# Altium project Blue Tractor_v1.1-2021.PrjPCB (part 1 of 4)
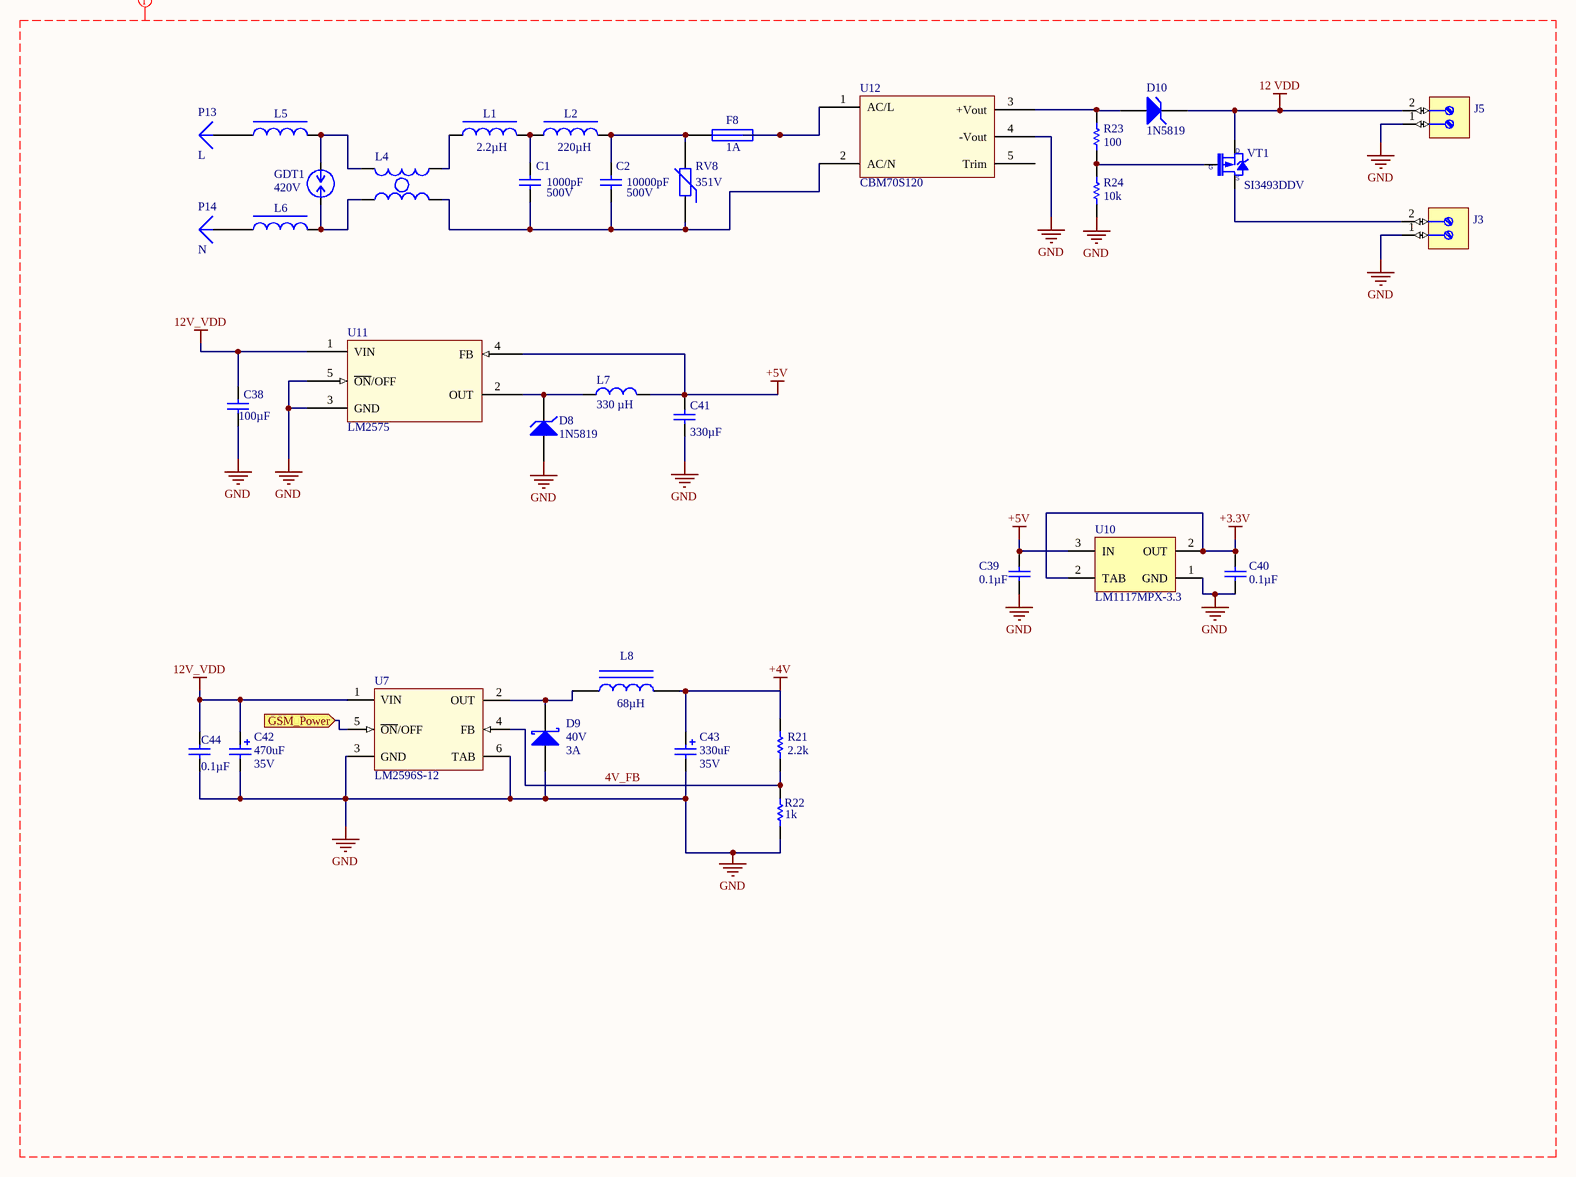
[diagram p0: [09] EMC-Power.SchDoc]
13 sheets, 161 parts. Net scope: global (net labels, ports and power ports of the same name join across sheets).
Sheets:
  [09] EMC-Power.SchDoc
  Blue Tractor_v1.1-2021.SchDoc
    STM32F4 = [01] - MC.SchDoc
    MOSFET = [11] - MOSFET.SchDoc
    RFID = [10] - RFID.SchDoc
    USB = [04] - USB-UART.SchDoc
    LoRa = [08] -LoRa_RAK3172.SchDoc
    ESP32-S2-MINI-1U = [03] - WiFi.SchDoc
    SD = [07] - SD.SchDoc
    GSM = [02] - GSM.SchDoc
    1 Wire_TMP = [05] - Sensors.SchDoc
    IO_Ports = [06] - IO_Ports.SchDoc
    RTC = [12] - RTC.SchDoc

## Sheet [09] EMC-Power.SchDoc
size A3; PageSetup: Record=PageOptions|CenterHorizontal=True|CenterVertical=True|PrintScale=0.94|XCorrection=1.00|YCorrection=1.00|PrintKind=1|BorderSize=5000000|LeftOffset=0|BottomOffset=0|Orientation=1|PaperLength=1000|PaperWidth=1000|Scale=100|PaperSource=7|PrintQuality=-4|MediaType=1|DitherType=10|PaperKind=A4|PrintScaleMode=1; DecimalNumber: Децимальный номер; HeadOfSector: Нач. сектора; MainDevice: Перв.примен.; Name: Наименование

### Parts
C1  Capacitance: 1000pF  Voltage - Rated: 500V  [Cap 1206]  (hidden comment: Capacitor)
C2  Capacitance: 10000pF  Voltage - Rated: 500V  [Cap 1206]  (hidden comment: Capacitor)
C38  value 100µF  [Cap 0603]  (hidden comment: Capacitor)
C39  Capacitance: 0.1µF  [Cap 0603]  (hidden comment: Capacitor)
C40  Capacitance: 0.1µF  [Cap 0603]  (hidden comment: Capacitor)
C41  value 330µF  [Cap 0603]  (hidden comment: Capacitor)
C42  Capacitance: 470uF  Voltage Rating: 35V  [Aluminium SMD G]  (hidden comment: Capacitor Polarized)
C43  Capacitance: 330uF  Voltage: 35V  [Aluminium SMD G]  (hidden comment: Capacitor Polarized)
C44  Capacitance: 0.1µF  [Cap 0603]  (hidden comment: Capacitor)
D8  1N5819  [D100]
D9  Output Current: 3A  Voltage: 40V  [SMA]  (hidden comment: SK32)
D10  1N5819  [D100]
F8  value 1A  [Fuse]  (hidden comment: Fuse)
GDT1  Voltage - DC Spark Over (Nom): 420V  [GDT]  (hidden comment: Gas Discharge Tube)
J3  (no value)  [PHOENIX_1715721]
J5  (no value)  [PHOENIX_1715721]
L1  Inductance: 2.2µH  [Inductor VLS]  (hidden comment: Inductor)
L2  Inductance: 220µH  [SRR1260]  (hidden comment: Inductor)
L4  Current-compensated Chokes  [RN114_PM3700]  (value not drawn)
L5  Inductor  [FB20022-4B-RC]  (value not drawn)
L6  Inductor  [FB20022-4B-RC]  (value not drawn)
L7  value 330 µH  [IND4]  (hidden comment: Inductor)
L8  Inductance: 68µH  [SRR1208]  (hidden comment: SRR1210)
P13  L  [Socket]  (no BOM)
P14  N  [Socket]  (no BOM)
R21  Resistance: 2.2k  [Res-0603]  (hidden comment: Res1)
R22  Resistance: 1k  [Res-0603]  (hidden comment: Res1)
R23  Resistance: 100  [Res-0603]  (hidden comment: Res1)
R24  Resistance: 10k  [Res-0603]  (hidden comment: Res1)
RV8  Varistor Voltage (Min): 351V  [S14k250]  (hidden comment: Res Varistor)
U7  LM2596S-12  (graphical)
U10  LM1117MPX-3.3  [SOT-223]
U11  LM2575
U12  CBM70S120
VT1  SI3493DDV

### Ports
GSM_Power (in)

### Nets
12 VDD: D10.2(K) J5.2 VT1.16
12V_VDD: C38.2 C42.1 C44.2 U7.1(VIN) U11.1(VIN)
+3.3V: C40.2 U10.2(OUT)
+4V: C43.1 L8.2 R21.1
+5V: C39.2 C41.2 L7.2 U10.3(IN) U11.4(FB)
GND: C38.1 C39.1 C40.1 C41.1 C42.2 C43.2 C44.1 D8.1(A) D9.1(A) J3.1 J5.1 R22.1 R24.2 U7.3(GND) U7.6(TAB) U10.1(GND) U11.3(GND) U11.5(~{ON}/OFF) U12.4(-Vout)
4V_FB: R21.2 R22.2 U7.4(FB)
NetC1_1: C1.1 C2.1 L4.2 RV8.1 U12.2(AC/N)
NetC1_2: C1.2 L1.2 L2.1
NetC2_2: C2.2 F8.1 L2.2 RV8.2
NetD8_2: D8.2(K) L7.1 U11.2(OUT)
NetD9_2: D9.2(K) L8.1 U7.2(OUT)
NetD10_1: D10.1(A) R23.1 U12.3(+Vout)
NetF8_2: F8.2 U12.1(AC/L)
NetGDT1_1: GDT1.1 L4.3 L5.2
NetGDT1_2: GDT1.2 L4.1 L6.2
NetJ3_2: J3.2 VT1.17
NetL1_1: L1.1 L4.4
NetL5_1: L5.1 P13.1
NetL6_1: L6.1 P14.1
NetR23_2: R23.2 R24.1 VT1.15(PG)
NetU7_5: U7.5(~{ON}/OFF) ; port GSM_Power

Not connected (* = marked no-connect by the designer): U12 5(Trim)

### Layout directives
net class HV: 4V_FB, 12 VDD, 12V_VDD, +3.3V, +4V, +5V, GND

### Notes on the sheet
- Title
- Size:
- Date:
- A3
- Number:
- Time:
- Revision:
- Sheet
- of
- File:
- (in symbol SI3493DVV-T1-GE3) D; G; S

### Library data of the parts
C1 = 1: Chip Capacitor Nonpolar; Manufacturer: Samsung Electro-Mechanics America, Inc; Manufacturer Part Number: CL31B102KGFNFNE; ID: 1; Lybrary Path: Capacitors.SchLib; Tolerance: ±10%; Temperature Coefficient: X7R; Published: 8-Jun-2000; LatestRevisionDate: 17-Jul-2002; LatestRevisionNote: Re-released for DXP Platform.; PackageReference: RAD-0.3; Publisher: Altium Limited; PackageDescription: Radial Cap, Thru-Hole; 2 Leads; 0.3 in Pin Spacing; Supplier 1: Digi-Key; Supplier Part Number 1: 1276-3065-1-ND; RoHS: RoHS Compliant; Category: Capacitors; Stock 1: 2501; Pricing 1: 1=0.19, 10=0.126, 25=0.092, 100=0.0643, 500=0.0459, 1000=0.03902 (USD); Packaging: Cut Tape (CT); Mounting Type: Surface Mount, MLCC; Operating Temperature: -55°C ~ 125°C; Applications: General Purpose; Ratings: -; Package / Case: 1206 (3216 Metric); Size / Dimension: 0.126" L x 0.063" W (3.20mm x 1.60mm); Height - Seated (Max): -; Thickness (Max): 0.055" (1.40mm); Lead Spacing: -; Features: -; Lead Style: -; ComponentLink1URL: http://www.samsungsem.com/kr/front/downloadcms.do?path=/kr/support/product-search/mlcc/__icsFiles/afieldfile/2014/11/05&fileName=S_CL31B102KGFNFNE.pdf; ComponentLink1Description: http://www.samsungsem.com/kr/front/downloadcms.do?path=/kr/support/product-search/mlcc/__icsFiles/afieldfile/2014/11/05&fileName=S_CL31B102KGFNFNE.pdf
C2 = 1: Chip Capacitor Nonpolar; Manufacturer: Samsung Electro-Mechanics America, Inc; Manufacturer Part Number: CL31B103KGFNNNE; Tolerance: ±10%; Temperature Coefficient: X7R; Supplier 1: Digi-Key; Supplier Part Number 1: 1276-3076-1-ND; RoHS: RoHS Compliant; Category: Capacitors; Stock 1: 4460; Pricing 1: 1=0.26, 10=0.216, 25=0.1484, 100=0.108, 500=0.07156, 1000=0.06345 (USD); Packaging: Cut Tape (CT); Mounting Type: Surface Mount, MLCC; Operating Temperature: -55°C ~ 125°C; Applications: General Purpose; Ratings: -; Package / Case: 1206 (3216 Metric); Size / Dimension: 0.126" L x 0.063" W (3.20mm x 1.60mm); Height - Seated (Max): -; Thickness (Max): 0.055" (1.40mm); Lead Spacing: -; Features: -; Lead Style: -; ComponentLink1URL: http://www.samsungsem.com/kr/front/downloadcms.do?path=/kr/support/product-search/mlcc/__icsFiles/afieldfile/2014/11/05&fileName=S_CL31B103KGFNNNE.pdf; ComponentLink1Description: http://www.samsungsem.com/kr/front/downloadcms.do?path=/kr/support/product-search/mlcc/__icsFiles/afieldfile/2014/11/05&fileName=S_CL31B103KGFNNNE.pdf
C38 C41 = 1: Capacitor 0603; Manufacturer: Kemet; Manufacturer Part Number: C0603C473K5RACTU; Capacitance: 0.047µF; Tolerance: ±10%; Voltage - Rated: 50V; Temperature Coefficient: X7R; Supplier 1: Digi-Key; Supplier Part Number 1: 399-7933-1-ND; RoHS: RoHS Compliant; Category: Capacitors; Stock 1: 66523; Pricing 1: 1=0.1, 10=0.059, 25=0.0416, 50=0.0318, 100=0.0269, 250=0.02204, 1000=0.0144 (USD); Packaging: Cut Tape (CT); Mounting Type: Surface Mount, MLCC; Operating Temperature: -55°C ~ 125°C; Applications: General Purpose; Ratings: -; Package / Case: 0603 (1608 Metric); Size / Dimension: 0.063" L x 0.031" W (1.60mm x 0.80mm); Height - Seated (Max): -; Thickness (Max): 0.034" (0.87mm); Lead Spacing: -; Features: -; Lead Style: -; ComponentLink1URL: http://www.kemet.com/docfinder?Partnumber=C0603C473K5RACTU; ComponentLink1Description: http://www.kemet.com/docfinder?Partnumber=C0603C473K5RACTU
C39 C40 C44 = 1: Chip Capacitor Nonpolar; Manufacturer: Kemet; Manufacturer Part Number: C0603C104K5RACTU; Tolerance: ±10%; Voltage - Rated: 50V; Temperature Coefficient: X7R; Supplier 1: Digi-Key; Supplier Part Number 1: 399-5089-1-ND; RoHS: RoHS Compliant; Category: Capacitors; Stock 1: 3992655; Pricing 1: 1=0.1, 10=0.041, 50=0.0222, 100=0.0187, 250=0.01532, 500=0.0131, 1000=0.0102 (USD); Packaging: Cut Tape (CT); Mounting Type: Surface Mount, MLCC; Operating Temperature: -55°C ~ 125°C; Applications: General Purpose; Ratings: -; Package / Case: 0603 (1608 Metric); Size / Dimension: 0.063" L x 0.031" W (1.60mm x 0.80mm); Height - Seated (Max): -; Thickness (Max): 0.034" (0.87mm); Lead Spacing: -; Features: -; Lead Style: -; ComponentLink1URL: http://www.kemet.com/docfinder?Partnumber=C0603C104K5RACTU; ComponentLink1Description: http://www.kemet.com/docfinder?Partnumber=C0603C104K5RACTU
C42 = 4: Aluminium SMD Capacitors; Manufacturer: Nichicon; Manufacturer Part Number: UCL1V471MNL1GS; Tolerance: 20%; Ripple Current: 1.19A; Impedance: 60mR; Leakage Current: 3uA; Life (Hours): 2000Hour; Dissipation Factor: 0.12%; Supplier 1: Digi-Key; Supplier Part Number 1: 493-3961-6-ND; Stock 1: 25815; Pricing 1: 1=0.98, 10=0.747, 100=0.5345 (USD); Mount: Surface Mount; Case/Package: Radial; Number of Pins: 2; Material: Aluminium; Dielectric Material: Aluminium; Min Operating Temperature: -55°C; Max Operating Temperature: 105°C; Packaging: Tape and Reel; Package Quantity: 1; Voltage Rating (DC): 35V; Ripple Current (AC): 1.19A; Termination: SMD/SMT; Diameter: 10mm; Length: 13.5mm; Height: 13.5mm; Height - Seated (Max): 0.531inch; Radiation Hardening: No; REACH SVHC: No SVHC; Lead Free: Lead Free; ComponentLink1URL: https://datasheet.ciiva.com/30521/getdatasheetpartid-743876-30521937.pdf; ComponentLink1Description: https://datasheet.ciiva.com/30521/getdatasheetpartid-743876-30521937.pdf; ComponentLink2URL: https://datasheet.ciiva.com/98/e-cl-98467.pdf; ComponentLink2Description: https://datasheet.ciiva.com/98/e-cl-98467.pdf; ComponentLink3URL: https://datasheet.ciiva.com/98/e-cl-98468.pdf; ComponentLink3Description: https://datasheet.ciiva.com/98/e-cl-98468.pdf; ComponentLink4URL: https://datasheet.ciiva.com/98/e-cl-98469.pdf; ComponentLink4Description: https://datasheet.ciiva.com/98/e-cl-98469.pdf; ComponentLink5URL: https://datasheet.ciiva.com/22661/1910939-22661894.pdf; ComponentLink5Description: https://datasheet.ciiva.com/22661/1910939-22661894.pdf; ComponentLink6URL: https://datasheet.ciiva.com/28458/1910939-28458006.pdf; ComponentLink6Description: https://datasheet.ciiva.com/28458/1910939-28458006.pdf; ComponentLink7URL: https://datasheet.ciiva.com/6153/e-cl-6153975.pdf; ComponentLink7Description: https://datasheet.ciiva.com/6153/e-cl-6153975.pdf; ComponentLink8URL: https://datasheet.ciiva.com/11683/e-cl-11683743.pdf; ComponentLink8Description: https://datasheet.ciiva.com/11683/e-cl-11683743.pdf; ComponentLink9URL: https://datasheet.ciiva.com/16502/e-cl-16502287.pdf; ComponentLink9Description: https://datasheet.ciiva.com/16502/e-cl-16502287.pdf
C43 = 4: Aluminium SMD Capacitors; Manufacturer: Panasonic; Manufacturer Part Number: EEE-1VA331P; Ripple Current (AC): 350mA; Tolerance: 20%; Polarity: Polar; Life (Hours): 2000Hour; Leakage Current: 3uA; Supplier 1: Digi-Key; Supplier Part Number 1: PCE3959DKR-ND; Stock 1: 40084; Pricing 1: 1=0.65, 10=0.482, 100=0.3304 (USD); Mount: Surface Mount,PCB; Case/Package: Radial; Contact Plating: Tin; Min Operating Temperature: -40°C; Max Operating Temperature: 85°C; Voltage Rating: 35V; Packaging: Tape and Reel; Ripple Current: 350mA; Voltage Rating (DC): 35V; Package Quantity: 500; Termination: SMD/SMT; Diameter: 10mm; Length: 10.5mm; Height: 10.2mm; Height - Seated (Max): 0.402inch; Radiation Hardening: No; REACH SVHC: No SVHC; Lead Free: Lead Free; ComponentLink1URL: https://datasheet.ciiva.com/16389/aba0000ce2-16389541.pdf; ComponentLink1Description: https://datasheet.ciiva.com/16389/aba0000ce2-16389541.pdf; ComponentLink2URL: https://datasheet.ciiva.com/30235/11aba0000ce2-30235093.pdf; ComponentLink2Description: https://datasheet.ciiva.com/30235/11aba0000ce2-30235093.pdf; ComponentLink3URL: https://datasheet.ciiva.com/46374/aba0000ce2-46374421.pdf; ComponentLink3Description: https://datasheet.ciiva.com/46374/aba0000ce2-46374421.pdf; ComponentLink4URL: https://datasheet.ciiva.com/43470/aba0000ce2-43470694.pdf; ComponentLink4Description: https://datasheet.ciiva.com/43470/aba0000ce2-43470694.pdf; ComponentLink5URL: https://datasheet.ciiva.com/14593/70255710-14593929.pdf; ComponentLink5Description: https://datasheet.ciiva.com/14593/70255710-14593929.pdf; ComponentLink6URL: https://datasheet.ciiva.com/24025/aba0000ce2-40801-24025561.pdf; ComponentLink6Description: https://datasheet.ciiva.com/24025/aba0000ce2-40801-24025561.pdf; ComponentLink7URL: https://datasheet.ciiva.com/14599/70255710-14599770.pdf; ComponentLink7Description: https://datasheet.ciiva.com/14599/70255710-14599770.pdf; ComponentLink8URL: https://datasheet.ciiva.com/17534/aba0000ce2-17534540.pdf; ComponentLink8Description: https://datasheet.ciiva.com/17534/aba0000ce2-17534540.pdf; ComponentLink9URL: https://datasheet.ciiva.com/31414/aba0000ce2-31414702.pdf; ComponentLink9Description: https://datasheet.ciiva.com/31414/aba0000ce2-31414702.pdf
D8 D10 = D Zener: Zener Diode; Published: 8-Jun-2000; LatestRevisionDate: 17-Jul-2002; LatestRevisionNote: Re-released for DXP Platform.; PackageReference: DIODE-0.7; Publisher: Altium Limited
D9 = SK32: Schottky Rectifier; Manufacturer: Diodes; Manufacturer Part Number: B340A-13-F; Peak Reverse Current: 500uA; Forward Voltage: 500mV; Max Forward Surge Current (Ifsm): 80A; Element Configuration: Single; Polarity: Standard; Capacitance: 250pF; ComponentLink1Description: Manufacturer Link; ComponentLink1URL: http://www.irf.com/; ComponentLink2Description: Datasheet; ComponentLink2URL: http://www.irf.com/product-info/datasheets/data/18tq.pdf; Supplier 1: Digi-Key; Supplier Part Number 1: B340A-FDIDKR-ND; Stock 1: 761735; Pricing 1: 1=0.46, 10=0.373, 100=0.2538, 500=0.19034, 1000=0.14276 (USD); Mount: Surface Mount; Case/Package: SMA; Number of Pins: 2; Weight: 0.002258oz; Contact Plating: Tin,Matte; Min Operating Temperature: -55°C; Max Operating Temperature: 125°C; Forward Current: 3A; Packaging: Tape and Reel; Package Quantity: 5000; Average Rectified Current: 3A; Max Repetitive Reverse Voltage (Vrrm): 40V; Peak Non-Repetitive Surge Current: 80A; Termination: SMD/SMT; Voltage Rating (DC): 40V; Current Rating: 3A; Current: 3A; Max Reverse Voltage (DC): 40V; Length: 4.6mm; Height: 2.3mm; Width: 2.92mm; Radiation Hardening: No; REACH SVHC: No SVHC; Lead Free: Lead Free; ComponentLink3URL: https://datasheet.ciiva.com/4245/861ds30891-4245763.pdf; ComponentLink3Description: https://datasheet.ciiva.com/4245/861ds30891-4245763.pdf; ComponentLink4URL: https://datasheet.ciiva.com/26949/getdatasheetpartid-143394-26949352.pdf; ComponentLink4Description: https://datasheet.ciiva.com/26949/getdatasheetpartid-143394-26949352.pdf; ComponentLink5URL: https://datasheet.ciiva.com/1177/ds30891-1177476.pdf; ComponentLink5Description: https://datasheet.ciiva.com/1177/ds30891-1177476.pdf; ComponentLink6URL: https://datasheet.ciiva.com/1240/ds30891-1240228.pdf; ComponentLink6Description: https://datasheet.ciiva.com/1240/ds30891-1240228.pdf; ComponentLink7URL: https://datasheet.ciiva.com/913/ds30891-913637.pdf; ComponentLink7Description: https://datasheet.ciiva.com/913/ds30891-913637.pdf; ComponentLink8URL: https://datasheet.ciiva.com/913/ds30891-913638.pdf; ComponentLink8Description: https://datasheet.ciiva.com/913/ds30891-913638.pdf; ComponentLink9URL: https://datasheet.ciiva.com/913/ds30891-913639.pdf; ComponentLink9Description: https://datasheet.ciiva.com/913/ds30891-913639.pdf; ComponentLink10URL: https://datasheet.ciiva.com/46393/1911813-46393773.pdf; ComponentLink10Description: https://datasheet.ciiva.com/46393/1911813-46393773.pdf
F8 = 12: Manufacturer: TE Connectivity Raychem Circuit Protection; Manufacturer Part Number: LVR100S; Voltage - Max: 240V; Current - Max: 10A; Current - Trip (It): 2A; R Min/Max: 0.200 ~ 0.330 Ohm; Time to Trip: 21s; Supplier 1: Digi-Key; Supplier Part Number 1: LVR100S-ND; RoHS: RoHS Compliant; Category: Circuit Protection; Stock 1: 4143; Pricing 1: 1=1.74, 10=1.54, 100=1.38, 500=1.18, 1000=1.12, 2000=1.09001, 5000=1.02, 10000=0.87 (USD); Packaging: Bulk; Current - Hold (Ih) (Max): 1A; Package / Case: Radial, Disc; ComponentLink1URL: http://www.te.com/commerce/DocumentDelivery/DDEController?Action=srchrtrv&DocNm=SCD26610&DocType=SS&DocLang=EN; ComponentLink1Description: http://www.te.com/commerce/DocumentDelivery/DDEController?Action=srchrtrv&DocNm=SCD26610&DocType=SS&DocLang=EN
GDT1 = 33: Manufacturer: TE Connectivity Raychem Circuit Protection; Manufacturer Part Number: GTCA28-421M-R05; Impulse Discharge Current (8/20µs): 5000A (5kA); Tolerance: ±20%; Number of Poles: 2; Fail Short: No; Supplier 1: Digi-Key; Supplier Part Number 1: GTCA28-421M-R05-ND; RoHS: RoHS Compliant; Category: Circuit Protection; Stock 1: 994; Pricing 1: 1=0.56, 10=0.517, 100=0.47, 500=0.3666, 1000=0.31584, 5000=0.28952, 10000=0.2444, 50000=0.235, 1000000=0.2256 (USD); Packaging: Tray; Mounting Type: Through Hole; Package / Case: Axial Cylinder; ComponentLink1URL: http://www.te.com/commerce/DocumentDelivery/DDEController?Action=srchrtrv&DocNm=SCD27654&DocType=SS&DocLang=EN; ComponentLink1Description: http://www.te.com/commerce/DocumentDelivery/DDEController?Action=srchrtrv&DocNm=SCD27654&DocType=SS&DocLang=EN
J3 J5 = PHOENIX_1715721: Terminal Block, 2 Positions, Screw Connection; Part Description: 17.5A, 400V, Terminal Block, Pitch 5.08mm, 2 Positions, Screw Connection; Manufacturer: PHOENIX CONTACT; Manufacturer Part Number: 1715721 (MKDS 1,5/2-5,08); PressFit: No; Part Number: PHOENIX_1715721; Component Kind: Standard; Component Type: Standard; Pin Count: 2; Mounted: Yes; Socket: No; SMD: No; Sense: No; Status: None; ComponentHeight: 13.8mm; HelpURL: \\cern.ch\dfs\Applications\Altium\Datasheets\PHOENIX_1715721.pdf; Author: CERN DEM JLC; CreateDate: 06.01.2010; LatestRevisionDate: 25.02.2013
L1 = 5: Inductors throgh hole; Manufacturer: TDK Corporation; Manufacturer Part Number: VLS252012T-2R2M1R3; Type: Wirewound; Tolerance: ±20%; Current Rating: 1.3A; Current - Saturation: 1.8A; Shielding: Shielded; DC Resistance (DCR): 155 mOhm Max; Frequency - Test: 1MHz; Supplier 1: Digi-Key; Supplier Part Number 1: 445-3670-1-ND; RoHS: RoHS Compliant; Category: Inductors, Coils, Chokes; Stock 1: 12814; Pricing 1: 1=0.81, 10=0.72, 50=0.585, 100=0.54, 500=0.468, 1000=0.396 (USD); Packaging: Cut Tape (CT); Material - Core: -; Q @ Freq: -; Frequency - Self Resonant: -; Operating Temperature: -40°C ~ 105°C; Mounting Type: Surface Mount; Package / Case: 1008 (2520 Metric); Size / Dimension: 0.098" L x 0.079" W (2.50mm x 2.00mm); Height - Seated (Max): 0.039" (1.00mm); Supplier Device Package: 1008 (2520 Metric); ComponentLink1URL: http://media.digikey.com/pdf/Data%20Sheets/TDK%20PDFs/vls252012.pdf; ComponentLink1Description: http://media.digikey.com/pdf/Data%20Sheets/TDK%20PDFs/vls252012.pdf
L2 = 5: Inductors throgh hole; Manufacturer: Bourns Inc.; Manufacturer Part Number: SRR1260-221K; Type: Wirewound; Material - Core: Ferrite; Tolerance: ±10%; Current Rating: 1.38A; Current - Saturation: 1.3A; Shielding: Shielded; DC Resistance (DCR): 380 mOhm Max; Q @ Freq: 22 @ 796kHz; Frequency - Self Resonant: 4.2MHz; Frequency - Test: 100kHz; Supplier 1: Digi-Key; Supplier Part Number 1: SRR1260-221KCT-ND; RoHS: RoHS Compliant; Category: Inductors, Coils, Chokes; Stock 1: 9927; Pricing 1: 1=0.99, 10=0.93, 25=0.868, 50=0.744, 100=0.7068, 250=0.6448 (USD); Packaging: Cut Tape (CT); Operating Temperature: -40°C ~ 125°C; Mounting Type: Surface Mount; Package / Case: Nonstandard; Size / Dimension: 0.492" L x 0.492" W (12.50mm x 12.50mm); Height - Seated (Max): 0.256" (6.50mm); Supplier Device Package: -; ComponentLink1URL: http://www.bourns.com/data/global/pdfs/SRR1260.pdf; ComponentLink1Description: http://www.bourns.com/data/global/pdfs/SRR1260.pdf
L4 = 1: Current-compensated Chokes RN114; Manufacturer: Schaffner EMC Inc; Manufacturer Part Number: RN114-1-02; Value: 10mH; ID: 1; Filter Type: Power Line; Number of Lines: 2; Inductance: 15mH; Current: 1A; DC Resistance (DCR): 375 mOhm; Supplier 1: Digi-Key; Supplier Part Number 1: 817-1539-ND; RoHS: RoHS Compliant; Category: Filters; Stock 1: 4897; Pricing 1: 1=2.84, 10=2.599, 25=2.3624, 50=1.9846, 100=1.701, 250=1.60652, 500=1.512, 1000=1.4175, 2500=1.3965 (USD); Packaging: Tray; Impedance: -; Mounting Type: Through Hole; Size / Dimension: 0.886" L x 0.846" W (22.50mm x 21.50mm); Height (Max): 0.531" (13.50mm); Package / Case: Horizontal, 4 PC Pin; Operating Temperature: -40°C ~ 125°C; ComponentLink1URL: http://schaffner.com/en/products/datasheet-low-res/product/rn-series-common-mode-chokes.pdf; ComponentLink1Description: http://schaffner.com/en/products/datasheet-low-res/product/rn-series-common-mode-chokes.pdf
L5 L6 = 5: Inductors throgh hole; Manufacturer: Bourns Inc.; Impedance @ Frequency: 900 Ohm @ 100MHz; Current Rating: 5A; Filter Type: Differential Mode - Single; Supplier 1: Digi-Key; Supplier Part Number 1: FB20022-4B-RC-ND; Manufacturer Part Number: FB20022-4B-RC; RoHS: RoHS Compliant; Category: Filters; Stock 1: 1456; Pricing 1: 1=0.53, 10=0.445, 25=0.382, 50=0.342, 100=0.3023, 250=0.27048, 500=0.25456, 1000=0.23125 (USD); Packaging: Bulk; DC Resistance (DCR): -; Package / Case: Radial; Mounting Type: Through Hole; Height (Max): 0.394" (10.01mm); Size / Dimension: 0.236" Dia (5.99mm)
L8 = SRR1210: Magnetic-Core Inductor; Manufacturer: Bourns Inc.; Manufacturer Part Number: SRR1210-680M; Type: Wirewound; Material - Core: Ferrite; Tolerance: ±20%; Current Rating: 3A; Current - Saturation: 2.7A; Shielding: Shielded; DC Resistance (DCR): 102 mOhm Max; Q @ Freq: 12 @ 2.52MHz; Frequency - Self Resonant: 3.8MHz; Frequency - Test: 100kHz; Value: 68µH; Published: 24-Mar-1999; LatestRevisionDate: 17-Jul-2002; LatestRevisionNote: Re-released for DXP Platform.; PackageReference: AXIAL-0.9; Publisher: Altium Limited; PackageDescription: Axial Device, Thru-Hole; 2 Leads; 0.9 in Pin Spacing; Supplier 1: Digi-Key; Supplier Part Number 1: SRR1210-680MCT-ND; RoHS: RoHS Compliant; Category: Inductors, Coils, Chokes; Stock 1: 2411; Pricing 1: 1=1.06, 10=0.99, 25=0.924, 50=0.792, 100=0.7524 (USD); Packaging: Cut Tape (CT); Operating Temperature: -40°C ~ 125°C; Mounting Type: Surface Mount; Package / Case: Non Standard; Size / Dimension: 0.472" L x 0.472" W (12.00mm x 12.00mm); Height - Seated (Max): 0.394" (10.00mm); Supplier Device Package: -; ComponentLink1URL: http://www.bourns.com/data/global/pdfs/SRR1210.pdf; ComponentLink1Description: http://www.bourns.com/data/global/pdfs/SRR1210.pdf
P13 P14 = Plug: LatestRevisionDate: 17-Jul-2002; LatestRevisionNote: Re-released for DXP Platform.; Publisher: Altium Limited
R21 R23 R24 = 1: Chip Resistor; Manufacturer: Panasonic; Manufacturer Part Number: ERJ-3GEYJ222V; Power Rating: 100mW; Tolerance: 5%; Voltage Rating: 75V; Temperature Coefficient: 200ppm/°C; Voltage Rating (DC): 50V; ComponentLink1URL: https://datasheet.ciiva.com/11821/0900766b80f806dd-11821453.pdf; ComponentLink1Description: https://datasheet.ciiva.com/11821/0900766b80f806dd-11821453.pdf; ComponentLink2URL: https://datasheet.ciiva.com/34303/1988639-34303614.pdf; ComponentLink2Description: https://datasheet.ciiva.com/34303/1988639-34303614.pdf; ComponentLink3URL: https://datasheet.ciiva.com/16760/70255313-16760341.pdf; ComponentLink3Description: https://datasheet.ciiva.com/16760/70255313-16760341.pdf; ComponentLink4URL: https://datasheet.ciiva.com/9117/aoa0000ce1-9117127.pdf; ComponentLink4Description: https://datasheet.ciiva.com/9117/aoa0000ce1-9117127.pdf; ComponentLink5URL: https://datasheet.ciiva.com/46380/1500035-46380411.pdf; ComponentLink5Description: https://datasheet.ciiva.com/46380/1500035-46380411.pdf; ComponentLink6URL: https://datasheet.ciiva.com/16765/70255313-16765244.pdf; ComponentLink6Description: https://datasheet.ciiva.com/16765/70255313-16765244.pdf; ComponentLink7URL: https://datasheet.ciiva.com/16199/aoa0000ce1-16199902.pdf; ComponentLink7Description: https://datasheet.ciiva.com/16199/aoa0000ce1-16199902.pdf; ComponentLink8URL: https://datasheet.ciiva.com/16853/aoa0000ce1-16853407.pdf; ComponentLink8Description: https://datasheet.ciiva.com/16853/aoa0000ce1-16853407.pdf; ComponentLink9URL: https://datasheet.ciiva.com/22758/1500035-22758223.pdf; ComponentLink9Description: https://datasheet.ciiva.com/22758/1500035-22758223.pdf; ComponentLink10URL: https://datasheet.ciiva.com/28584/1678796-28584095.pdf; ComponentLink10Description: https://datasheet.ciiva.com/28584/1678796-28584095.pdf; Supplier 1: Digi-Key; Supplier Part Number 1: P2.2KGDKR-ND; Stock 1: 1578287; Pricing 1: 1=0.1, 10=0.054, 100=0.022, 1000=0.00988, 2500=0.00858 (USD); Mount: Surface Mount; Case/Package: 0603; Case Code (Imperial): 0603; Case Code (Metric): 1608; Contact Plating: Tin; Min Operating Temperature: -55°C; Max Operating Temperature: 155°C; Package Quantity: 1; Packaging: Tape and Reel; Composition: Thick Film; Number of Terminations: 2; Military Standard: Not; Termination: SMD/SMT; Max Power Dissipation: 100mW; Features: Automotive AEC-Q200; Working Voltage: 75V; Length: 1.6mm; Height: 0.45mm; Width: 0.8mm; Depth: 0.8mm; Radiation Hardening: No; REACH SVHC: No SVHC; Lead Free: Lead Free
R22 = 1: Chip Resistor; Manufacturer: Panasonic; Manufacturer Part Number: ERJ-3GEYJ102V; Power Rating: 100mW; Tolerance: 5%; Voltage Rating: 75V; Temperature Coefficient: 200ppm/°C; Voltage Rating (DC): 50V; Supplier 1: Digi-Key; Supplier Part Number 1: P1.0KGDKR-ND; Stock 1: 2655329; Pricing 1: 1=0.1, 10=0.054, 100=0.022, 1000=0.00988, 2500=0.00858 (USD); Mount: Surface Mount; Case/Package: 0603; Weight: 7.1E-05oz; Case Code (Metric): 1608; Case Code (Imperial): 0603; Contact Plating: Tin; Min Operating Temperature: -55°C; Max Operating Temperature: 155°C; Packaging: Tape and Reel; Package Quantity: 1; Composition: Thick Film; Number of Terminations: 2; Termination: SMD/SMT; Military Standard: Not; Max Power Dissipation: 100mW; Working Voltage: 75V; Features: Automotive AEC-Q200; Length: 1.6mm; Height: 0.45mm; Width: 0.031inch; Depth: 0.8mm; Radiation Hardening: No; REACH SVHC: No SVHC; Lead Free: Lead Free; ComponentLink1URL: https://datasheet.ciiva.com/11808/0900766b80f806dd-11808320.pdf; ComponentLink1Description: https://datasheet.ciiva.com/11808/0900766b80f806dd-11808320.pdf; ComponentLink2URL: https://datasheet.ciiva.com/34303/1988487-34303608.pdf; ComponentLink2Description: https://datasheet.ciiva.com/34303/1988487-34303608.pdf; ComponentLink3URL: https://datasheet.ciiva.com/16740/aoa0000ce1-16740759.pdf; ComponentLink3Description: https://datasheet.ciiva.com/16740/aoa0000ce1-16740759.pdf; ComponentLink4URL: https://datasheet.ciiva.com/30224/4aoa0000ce1-30224167.pdf; ComponentLink4Description: https://datasheet.ciiva.com/30224/4aoa0000ce1-30224167.pdf; ComponentLink5URL: https://datasheet.ciiva.com/24159/aoa0000ce1-37422-24159481.pdf; ComponentLink5Description: https://datasheet.ciiva.com/24159/aoa0000ce1-37422-24159481.pdf; ComponentLink6URL: https://datasheet.ciiva.com/16787/70255313-16787626.pdf; ComponentLink6Description: https://datasheet.ciiva.com/16787/70255313-16787626.pdf; ComponentLink7URL: https://datasheet.ciiva.com/43460/1678796-43460714.pdf; ComponentLink7Description: https://datasheet.ciiva.com/43460/1678796-43460714.pdf; ComponentLink8URL: https://datasheet.ciiva.com/46451/1678796-46451226.pdf; ComponentLink8Description: https://datasheet.ciiva.com/46451/1678796-46451226.pdf; ComponentLink9URL: https://datasheet.ciiva.com/9117/aoa0000ce1-9117035.pdf; ComponentLink9Description: https://datasheet.ciiva.com/9117/aoa0000ce1-9117035.pdf; ComponentLink10URL: https://datasheet.ciiva.com/46386/1678796-46386459.pdf; ComponentLink10Description: https://datasheet.ciiva.com/46386/1678796-46386459.pdf; ComponentLink11URL: https://datasheet.ciiva.com/48532/aoa0000ce1-48532155.pdf; ComponentLink11Description: https://datasheet.ciiva.com/48532/aoa0000ce1-48532155.pdf; ComponentLink12URL: https://datasheet.ciiva.com/22783/1678796-22783822.pdf; ComponentLink12Description: https://datasheet.ciiva.com/22783/1678796-22783822.pdf; ComponentLink13URL: https://datasheet.ciiva.com/28532/1678796-28532126.pdf; ComponentLink13Description: https://datasheet.ciiva.com/28532/1678796-28532126.pdf; ComponentLink14URL: https://datasheet.ciiva.com/46371/1678796-46371934.pdf; ComponentLink14Description: https://datasheet.ciiva.com/46371/1678796-46371934.pdf
RV8 = 11: Manufacturer: EPCOS Inc; ID: 11; Current - Surge: 4.5kA; Number of Circuits: 1; Maximum AC Volts: 250VAC; Maximum DC Volts: 320VDC; Energy: 65J; Published: 24-Mar-1999; LatestRevisionDate: 29-May-2009; LatestRevisionNote: IPC-7351 Footprint Added.; PackageVersion: Mar-2003; PackageReference: 6-0805; Publisher: Altium Limited; PackageDescription: Chip Resistor 0805 Case Size; Code_IPC: RESC2012; Supplier 1: Digi-Key; Supplier Part Number 1: 495-4375-ND; Manufacturer Part Number: S14K250; RoHS: RoHS Compliant; Category: Circuit Protection; Stock 1: 1402; Pricing 1: 1=0.64, 10=0.449, 100=0.2959, 500=0.2192, 1000=0.18632, 5000=0.1644, 10000=0.15344 (USD); Packaging: Bulk; Package / Case: Disc 14mm; ComponentLink1URL: http://www.epcos.com/inf/70/db/var_11/SIOV_Leaded_StandarD.pdf; ComponentLink1Description: http://www.epcos.com/inf/70/db/var_11/SIOV_Leaded_StandarD.pdf
U10 = LM1117MPX-3.3: 800mA Low-Dropout Linear Regulator, 4-pin SOT-223; Manufacturer: Texas Instruments; Manufacturer Part Number: LM1117MPX-3.3/NOPB; Min Input Voltage: 2.6V; Max Input Voltage: 15V; Nominal Output Voltage: 3.3V; Dropout Voltage: 1.2V; Number of Outputs: 1; Polarity: Positive; Quiescent Current: 10mA; Accuracy: 1%; ComponentLink1Description: LM1117 Datasheet; ComponentLink1URL: http://www.national.com/ds/LM/LM1117.pdf; ComponentLink2Description: LM1117 Web Page; ComponentLink2URL: http://www.national.com/pf/LM/LM1117.html; ComponentLink3Description: MP04A Package Page; ComponentLink3URL: http://www.national.com/packaging/folders/mp04a.html; Supplier 1: Digi-Key; Supplier Part Number 1: LM1117MPX-3.3/NOPBDKR-ND; Stock 1: 120330; Pricing 1: 1=1.14, 10=1.015, 100=0.7912, 500=0.65364, 1000=0.51603 (USD); Mount: Surface Mount; Case/Package: SOT-223; Number of Pins: 4; Contact Plating: Tin,Matte; Min Operating Temperature: -40°C; Max Operating Temperature: 125°C; Output Current: 800mA; Packaging: Tape and Reel; Output Voltage: 3.3V; Max Output Current: 800mA; Current Rating: 800mA; Output Voltage Accuracy: 1%; Max Output Voltage: 3.3V; Length: 6.5mm; Height: 1.6mm; Width: 3.56mm; REACH SVHC: No SVHC; Lead Free: Lead Free; ComponentLink4URL: https://datasheet.ciiva.com/49027/1882372-49027926.pdf; ComponentLink4Description: https://datasheet.ciiva.com/49027/1882372-49027926.pdf; ComponentLink5URL: https://datasheet.ciiva.com/46370/1772317-46370251.pdf; ComponentLink5Description: https://datasheet.ciiva.com/46370/1772317-46370251.pdf
U12 = CBM70S120: AC-DC ~230-12
VT1 = SI3493DVV-T1-GE3: P-Channel 20-V MOSFET

## Sheet Blue Tractor_v1.1-2021.SchDoc
size A4
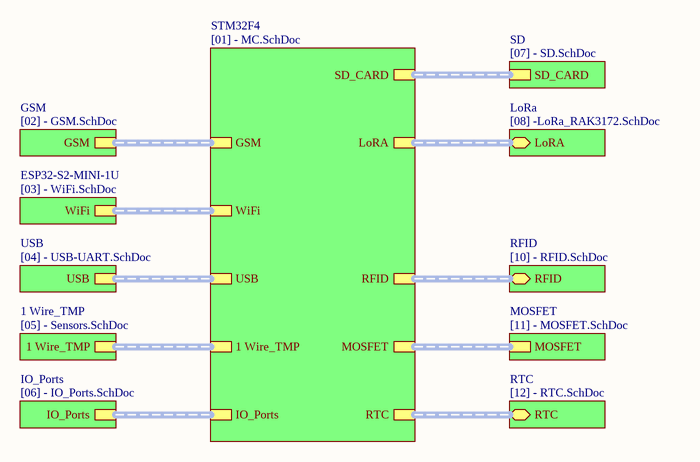
[diagram p1: Blue Tractor_v1.1-2021.SchDoc]

### Sub-sheets
1 Wire_TMP = [05] - Sensors.SchDoc: 1 Wire_TMP (harness 1-Wire_TMP)
ESP32-S2-MINI-1U = [03] - WiFi.SchDoc: WiFi (harness WiFi)
GSM = [02] - GSM.SchDoc: GSM (harness GSM)
IO_Ports = [06] - IO_Ports.SchDoc: IO_Ports (harness IO_Ports)
LoRa = [08] -LoRa_RAK3172.SchDoc: LoRA (harness LoRa_UART)
MOSFET = [11] - MOSFET.SchDoc: MOSFET (harness MOSFET)
RFID = [10] - RFID.SchDoc: RFID (harness RFID)
RTC = [12] - RTC.SchDoc: RTC (harness RTC)
SD = [07] - SD.SchDoc: SD_CARD (harness SD_CARD)
STM32F4 = [01] - MC.SchDoc: RFID (harness RFID), USB (harness USB), LoRA (harness LoRa_UART), WiFi (harness WiFi), SD_CARD (harness SD_CARD), GSM (harness GSM), 1 Wire_TMP (harness 1-Wire_TMP), IO_Ports (harness IO_Ports), RTC (harness RTC), MOSFET (harness MOSFET)
USB = [04] - USB-UART.SchDoc: USB (harness USB)

### Buses and harness runs
harness sheet 1 Wire_TMP/1 Wire_TMP = sheet STM32F4/1 Wire_TMP
harness sheet ESP32-S2-MINI-1U/WiFi = sheet STM32F4/WiFi
harness sheet GSM/GSM = sheet STM32F4/GSM
harness sheet IO_Ports/IO_Ports = sheet STM32F4/IO_Ports
harness sheet LoRa/LoRA = sheet STM32F4/LoRA
harness sheet MOSFET/MOSFET = sheet STM32F4/MOSFET
harness sheet RFID/RFID = sheet STM32F4/RFID
harness sheet RTC/RTC = sheet STM32F4/RTC
harness sheet SD/SD_CARD = sheet STM32F4/SD_CARD
harness sheet STM32F4/USB = sheet USB/USB

### Notes on the sheet
- Title
- Size:
- Date:
- A4
- Number:
- Time:
- Revision:
- Sheet
- of
- File: